# Altium schematic sheet ProgramCounter.SchDoc: Program Counter
size A4; Author: Ben Eater; DrawnBy: LittleYe233; SheetNumber: 7; SheetTotal: 7
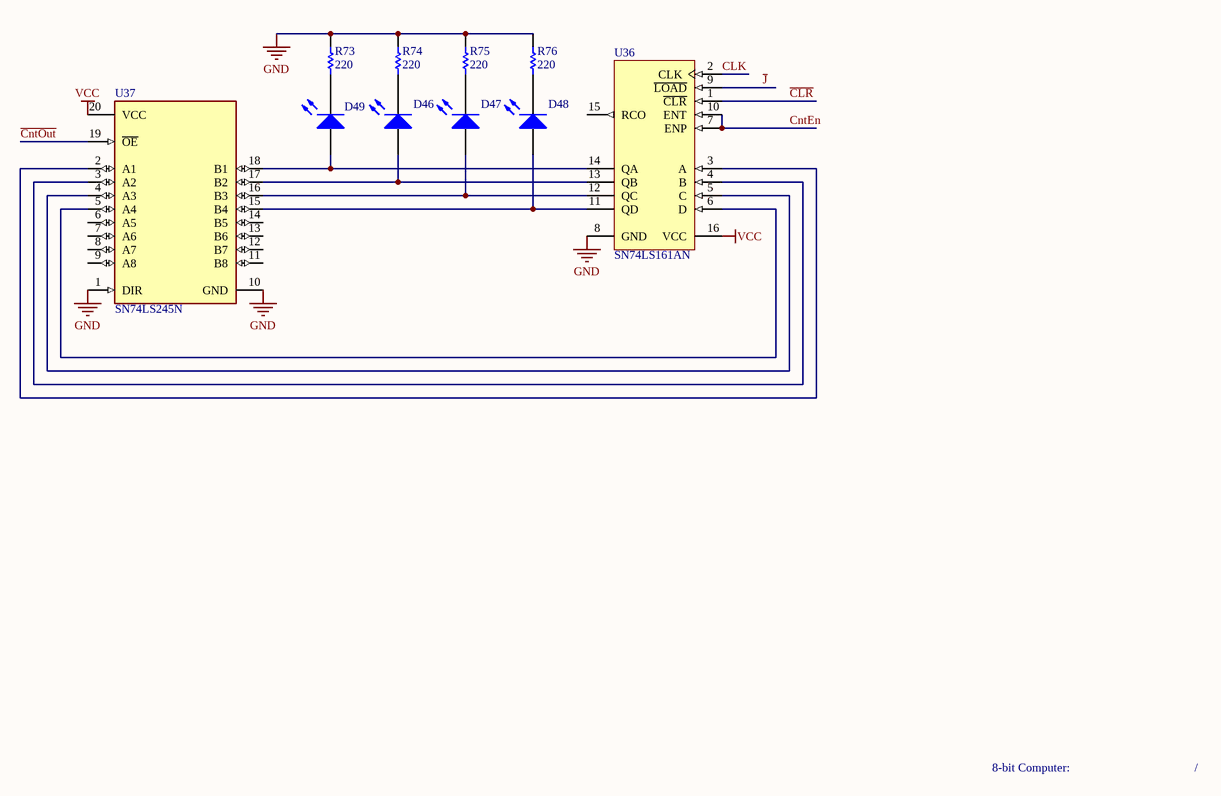
[diagram p0: ProgramCounter.SchDoc]

## Parts
D46  Light-Emitting Diode  (value not drawn)
D47  Light-Emitting Diode  (value not drawn)
D48  Light-Emitting Diode  (value not drawn)
D49  Light-Emitting Diode  (value not drawn)
R73  value 220  (hidden comment: Resistor)
R74  value 220  (hidden comment: Resistor)
R75  value 220  (hidden comment: Resistor)
R76  value 220  (hidden comment: Resistor)
U36  SN74LS161AN  [N0016A]
U37  SN74LS245N  [FP-N0020A-MFG]

## Nets
GND: R73.2 R74.2 R75.2 R76.2 U36.8(GND) U37.1(DIR) U37.10(GND)
VCC: U36.16(VCC) U37.20(VCC)
~{CLR}: U36.1(~{CLR})
~{CntOut}: U37.19(~{OE})
CLK: U36.2(CLK)
CntEn: U36.7(ENP) U36.10(ENT)
~{J}: U36.9(~{LOAD})
NetD46_1: D46.1(A) U36.13(QB) U37.17(B2)
NetD46_2: D46.2(K) R74.1
NetD47_1: D47.1(A) U36.12(QC) U37.16(B3)
NetD47_2: D47.2(K) R75.1
NetD48_1: D48.1(A) U36.11(QD) U37.15(B4)
NetD48_2: D48.2(K) R76.1
NetD49_1: D49.1(A) U36.14(QA) U37.18(B1)
NetD49_2: D49.2(K) R73.1
NetU36_3: U36.3(A) U37.2(A1)
NetU36_4: U36.4(B) U37.3(A2)
NetU36_5: U36.5(C) U37.4(A3)
NetU36_6: U36.6(D) U37.5(A4)

Not connected (* = marked no-connect by the designer): U36 15(RCO); U37 6(A5) 7(A6) 8(A7) 9(A8) 11(B8) 12(B7) 13(B6) 14(B5)

## Notes on the sheet
- 8-bit Computer:
- /

## Library data of the parts
D46-D49 = LED: AF: 1; BV: 0; BV_MAX: 1e99; EG: 1.11; FC: 0.5; IBV: 0.001; IS: 1e-14; MJSW: 0.33; NTUN: 30; TNOM: 27; XTI: 3; SimulationGenericComponent: True; CJO: 0; CJP: 0; CTA: 0; CTP: 0; FCS: 0.5; FV_MAX: 1e99; IKF: 0; IKR: 0; ISR: 1e-14; JSW: 0; JTUN: 0; JTUNSW: 0; KEG: 1; KF: 0; LEVEL: 1; N: 1; NBV: 1; NR: 1; NS: 1; PHP: 1; RS: 0; TCV: 0; TLEV: 0; TLEVC: 0; TM1: 0; TM2: 0; TPB: 0; TPHP: 0; TRS: 0; TRS2: 0; TT: 0; TTT1: 0; TTT2: 0; VJ: 1; XTITUN: 3
R73-R76 = Resistor: TC1: 0; SimulationGenericComponent: True; TC2: 0
U36 = CMP-1623-00512-2: Synchronous 4-Bit Binary Counters, N0016A, TUBE; Manufacturer: Texas Instruments; VCC(Max)(V): 5.25; tpd @ Nom Voltage(Max)(ns): 35; Output Type: CMOS; Input Type: TTL; ICC @ Nom Voltage(Max)(mA): 32; VCC(Min)(V): 4.75; Technology Family: LS; Voltage(Nom)(V): 5; Output Drive (IOL/IOH)(Max)(mA): 8/-0.4; Inputs: 1; Schmitt Trigger: No; Rating: Catalog; Bits(#): 4; Type: Binary; Generic Part Number: SN74LS161A; Code_JEDEC: MS-001; F @ Nom Voltage(Max)(Mhz): 35; Function: Counter; PackageReference: N0016A; DatasheetVersion: SDLS060; Operating Temperature Range(C): 0 to 70
U37 = CMP-1620-00419-3: IC TXRX NON-INVERT 5.25V 20DIP; Number of Bits per Element: 8; Polarity: Non-Inverting; Low Level Output Current: 24mA; Propagation Delay: 12ns; Min Supply Voltage: 4.75V; Number of Elements: 1; Quiescent Current: 62mA; Logic Function: Transceiver; Direction: Bidirectional; Operating Supply Voltage: 5V; High Level Output Current: -15mA; Mount: Through Hole; Min Operating Temperature: 0°C; Number of Outputs: 8; Max Operating Temperature: 70°C; Max Supply Voltage: 5.25V; Width: 6.35mm; Number of Pins: 20; RoHS Compliant: Yes; Turn-On Delay Time: 12ns; Termination: Through Hole; Number of Channels: 8; Number of Circuits: 8; Weight: 0.042297oz; Package Quantity: 20; Number of Transceivers: 8; Length: 24.33mm; Height: 4.57mm; REACH SVHC: No SVHC; Contact Plating: Gold; Number of Bits: 8; Lead Free: Lead Free; Case/Package: PDIP; Packaging: Rail/Tube; Radiation Hardening: No